# EAGLE design bldc_driver (EAGLE 6.4)
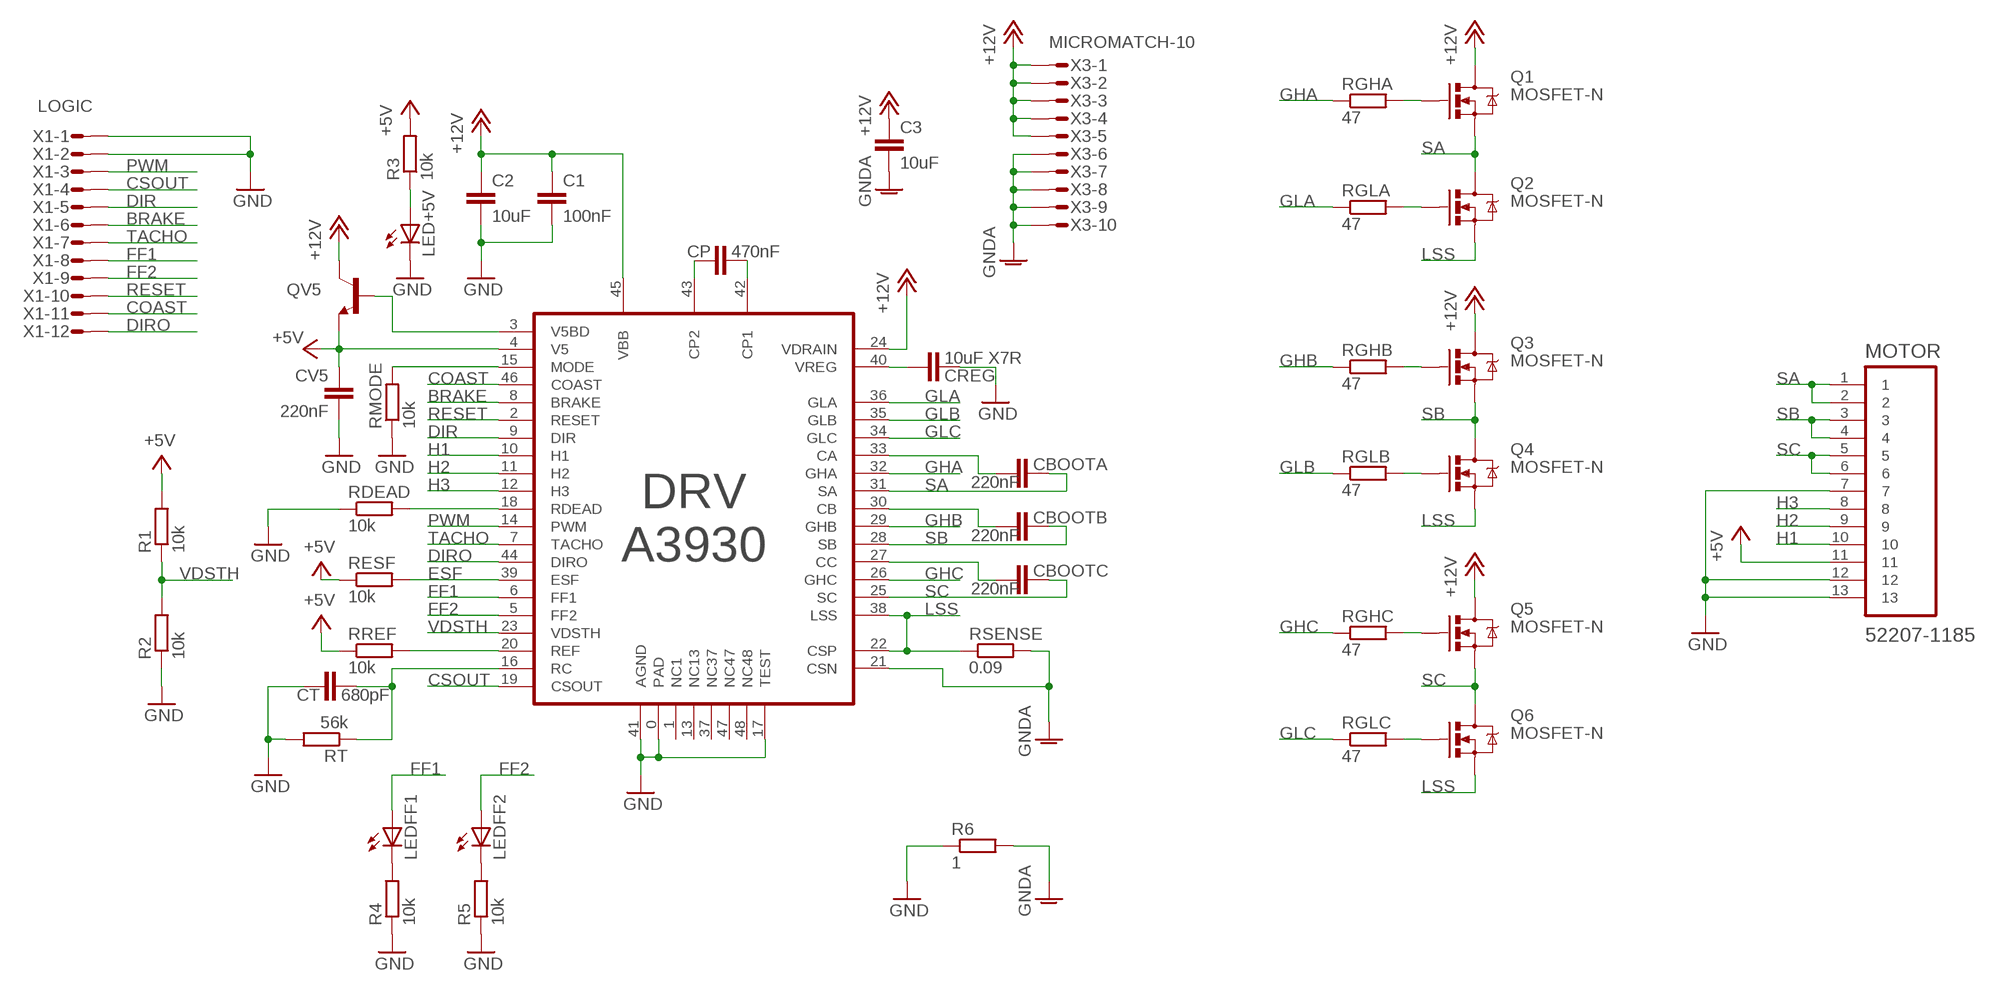
[diagram p0: schematic, sheet 1]

## Parts
C1  100nF  C-EUC0603  [C0603]
C2  10uF  C-EUC1206K  [C1206K]
C3  10uF  C-EUC1206K  [C1206K]
CBOOTA  220nF  C-EUC0603  [C0603]
CBOOTB  220nF  C-EUC0603  [C0603]
CBOOTC  220nF  C-EUC0603  [C0603]
CP  470nF  C-EUC0603  [C0603]
CREG  10uF X7R  C-EUC1206K  [C1206K]
CT  680pF  C-EUC0603  [C0603]
CV5  220nF  C-EUC0603  [C0603]
DRV  A3930  [LQFP-48]
LED+5V  LEDCHIPLED_0603  [CHIPLED_0603]
LEDFF1  LEDCHIPLED_0603  [CHIPLED_0603]
LEDFF2  LEDCHIPLED_0603  [CHIPLED_0603]
MOTOR  52207-1185  [MOLEX_52207-1185]
Q1  MOSFET-N  MOSFET-NCHANNELFDS6630A  [SO08]
Q2  MOSFET-N  MOSFET-NCHANNELFDS6630A  [SO08]
Q3  MOSFET-N  MOSFET-NCHANNELFDS6630A  [SO08]
Q4  MOSFET-N  MOSFET-NCHANNELFDS6630A  [SO08]
Q5  MOSFET-N  MOSFET-NCHANNELFDS6630A  [SO08]
Q6  MOSFET-N  MOSFET-NCHANNELFDS6630A  [SO08]
QV5  TRANSISTOR_NPNSOT23  [SOT23]
R1  10k  R-EU_R0603  [R0603]
R2  10k  R-EU_R0603  [R0603]
R3  10k  R-EU_R0603  [R0603]
R4  10k  R-EU_R0603  [R0603]
R5  10k  R-EU_R0603  [R0603]
R6  1  R-EU_R0603  [R0603]
RDEAD  10k  R-EU_R0603  [R0603]
RESF  10k  R-EU_R0603  [R0603]
RGHA  47  R-EU_R0603  [R0603]
RGHB  47  R-EU_R0603  [R0603]
RGHC  47  R-EU_R0603  [R0603]
RGLA  47  R-EU_R0603  [R0603]
RGLB  47  R-EU_R0603  [R0603]
RGLC  47  R-EU_R0603  [R0603]
RMODE  10k  R-EU_R0603  [R0603]
RREF  10k  R-EU_R0603  [R0603]
RSENSE  0.09  R-EU_R2010  [R2010]
RT  56k  R-EU_R0603  [R0603]
X1  LOGIC  MICROMATCH-12  [MICROMATCH-12]
X3  MICROMATCH-10  [MICROMATCH-10]

## Nets
+5V: CV5.2 DRV.4(V5) MOTOR.11 QV5.2(E) R1.2 R3.2 RESF.1 RREF.1
+12V: C1.1 C2.1 C3.1 DRV.24(VDRAIN) DRV.45(VBB) Q1.5(D) Q1.6(D) Q1.7(D) Q1.8(D) Q3.5(D) Q3.6(D) Q3.7(D) Q3.8(D) Q5.5(D) Q5.6(D) Q5.7(D) Q5.8(D) QV5.3(C) X3.1 X3.2 X3.3 X3.4 X3.5
BRAKE: DRV.8(BRAKE) X1.6
COAST: DRV.46(COAST) X1.11
CSOUT: DRV.19(CSOUT) X1.4
DIR: DRV.9(DIR) X1.5
DIRO: DRV.44(DIRO) X1.12
ESF: DRV.39(ESF) RESF.2
FF1: DRV.6(FF1) LEDFF1.A X1.8
FF2: DRV.5(FF2) LEDFF2.A X1.9
GHA: DRV.32(GHA) RGHA.1
GHB: DRV.29(GHB) RGHB.1
GHC: DRV.26(GHC) RGHC.1
GLA: DRV.36(GLA) RGLA.1
GLB: DRV.35(GLB) RGLB.1
GLC: DRV.34(GLC) RGLC.1
GND: C1.2 C2.2 CREG.2 CT.2 CV5.1 DRV.0(PAD) DRV.17(TEST) DRV.41(AGND) LED+5V.C MOTOR.7 MOTOR.12 MOTOR.13 R2.1 R4.1 R5.1 R6.1 RDEAD.1 RMODE.1 RT.2 X1.1 X1.2
GNDA: C3.2 DRV.21(CSN) R6.2 RSENSE.2 X3.6 X3.7 X3.8 X3.9 X3.10
H1: DRV.10(H1) MOTOR.10
H2: DRV.11(H2) MOTOR.9
H3: DRV.12(H3) MOTOR.8
LSS: DRV.22(CSP) DRV.38(LSS) Q2.1(S) Q2.2(S) Q2.3(S) Q4.1(S) Q4.2(S) Q4.3(S) Q6.1(S) Q6.2(S) Q6.3(S) RSENSE.1
N$1: Q1.4(G) RGHA.2
N$2: Q2.4(G) RGLA.2
N$3: Q3.4(G) RGHB.2
N$4: Q4.4(G) RGLB.2
N$5: Q5.4(G) RGHC.2
N$6: Q6.4(G) RGLC.2
N$7: CBOOTA.1 DRV.33(CA)
N$8: CREG.1 DRV.40(VREG)
N$9: CT.1 DRV.16(RC) RT.1
N$10: CP.1 DRV.42(CP1)
N$11: CP.2 DRV.43(CP2)
N$12: CBOOTB.1 DRV.30(CB)
N$14: DRV.18(RDEAD) RDEAD.2
N$15: CBOOTC.1 DRV.27(CC)
N$16: LED+5V.A R3.1
N$17: DRV.20(REF) RREF.2
N$18: DRV.15(MODE) RMODE.2
N$19: LEDFF1.C R4.2
N$20: LEDFF2.C R5.2
N$21: DRV.3(V5BD) QV5.1(B)
PWM: DRV.14(PWM) X1.3
RESET: DRV.2(RESET) X1.10
SA: CBOOTA.2 DRV.31(SA) MOTOR.1 MOTOR.2 Q1.1(S) Q1.2(S) Q1.3(S) Q2.5(D) Q2.6(D) Q2.7(D) Q2.8(D)
SB: CBOOTB.2 DRV.28(SB) MOTOR.3 MOTOR.4 Q3.1(S) Q3.2(S) Q3.3(S) Q4.5(D) Q4.6(D) Q4.7(D) Q4.8(D)
SC: CBOOTC.2 DRV.25(SC) MOTOR.5 MOTOR.6 Q5.1(S) Q5.2(S) Q5.3(S) Q6.5(D) Q6.6(D) Q6.7(D) Q6.8(D)
TACHO: DRV.7(TACHO) X1.7
VDSTH: DRV.23(VDSTH) R1.1 R2.2
Unconnected: DRV.1(NC1) DRV.13(NC13) DRV.37(NC37) DRV.47(NC47) DRV.48(NC48)

## Library data of the parts
C1-C3 CBOOTA CBOOTB CBOOTC CP CREG CT CV5 = rcl:C-EU: CAPACITOR, European symbol
DRV = rc13:A3930
LED+5V LEDFF1 LEDFF2 = led:LED: LED OSRAM: - CHIPLED LG R971, LG N971, LY N971, LG Q971, LY Q971, LO R971, LY R971 LH N974, LH R974 LS Q976, LO Q976, LY Q976 LO Q996 - Hyper CHIPLED LW Q18S LB Q993, LB Q99A, LB R99A - SideLED LS A670, LO A670, LY A670, LG A670, LP A670 LB A673, LV A673, LT A673, LW A673 LH A674 LY A675 LS A676, LA A676, LO A676, LY A676, LW A676 LS A679, LY A679, LG A679 - Hyper Micro SIDELED® LS Y876, LA Y876, LO Y876, LY Y876 LT Y87S - SmartLED LW L88C, LW L88S LB L89C, LB L89S, LG L890 LS L89K, LO L89K, LY L89K LS L896, LA L896, LO L896, LY L896 - TOPLED LS T670, LO T670, LY T670, LG T670, LP T670 LSG T670, LSP T670, LSY T670, LOP T670, LYG T670 LG T671, LOG T671, LSG T671 LB T673, LV T673, LT T673, LW T673 LH T674 LS T676, LA T676, LO T676, LY T676, LB T676, LH T676, LSB T676, LW T676 LB T67C, LV T67C, LT T67C, LS T67K, LO T67K, LY T67K, LW E67C LS E67B, LA E67B, LO E67B, LY E67B, LB E67C, LV E67C, LT E67C LW T67C LS T679, LY T679, LG T679 LS T770, LO T770, LY T770, LG T770, LP T770 LB T773, LV T773, LT T773, LW T773 LH T774 LS E675, LA E675, LY E675, LS T675 LS T776, LA T776, LO T776, LY T776, LB T776 LHGB T686 LT T68C, LB T68C - Hyper Mini TOPLED® LB M676 - Mini TOPLED Santana® LG M470 LS M47K, LO M47K, LY M47K Source: http://www.osram.convergy.de LUXEON: - LUMILED® LXK2-PW12-R00, LXK2-PW12-S00, LXK2-PW14-U00, LXK2-PW14-V00 LXK2-PM12-R00, LXK2-PM12-S00, LXK2-PM14-U00 LXK2-PE12-Q00, LXK2-PE12-R00, LXK2-PE12-S00, LXK2-PE14-T00, LXK2-PE14-U00 LXK2-PB12-K00, LXK2-PB12-L00, LXK2-PB12-M00, LXK2-PB14-N00, LXK2-PB14-P00, LXK2-PB14-Q00 LXK2-PR12-L00, LXK2-PR12-M00, LXK2-PR14-Q00, LXK2-PR14-R00 LXK2-PD12-Q00, LXK2-PD12-R00, LXK2-PD12-S00 LXK2-PH12-R00, LXK2-PH12-S00 LXK2-PL12-P00, LXK2-PL12-Q00, LXK2-PL12-R00 Source: www.luxeon.com KINGBRIGHT: KA-3528ASYC Source: www.kingbright.com
MOTOR = rc13:52207-1185: SOCKET FPC, SMT, 1MM, 10 WAY; MPN: 52207-1085; OC_FARNELL: 1079938; OC_NEWARK: 58J9503; PACKAGE: SOCKET FPC, SMT, 1MM, 10 WAY; SUPPLIER: Molex
Q1-Q6 = SparkFun-DiscreteSemi:MOSFET-NCHANNEL: Common NMOSFET Parts MFG P/N Store ID Prod ID FDD8780 TRANS-09984 SI7820DN TRANS-11055 FDS6630A IC-08089 2N7002PW TRANS-11151 FQP30N06L COM-10213 TRANS-10060 BSS123LT1G TRANS-08345 BSS138 TRANS-00830 BS170 2N7000; PROD_ID: IC-08089
QV5 = SparkFun-DiscreteSemi:TRANSISTOR_NPN: Generic NPN BJT. MMBT2222 is the common NPN we use. Double check against datasheet- not all devices are the same!
R1-R6 RDEAD RESF RGHA RGHB RGHC RGLA RGLB RGLC RMODE RREF RSENSE RT = rcl:R-EU_: RESISTOR, European symbol
X1 = con-amp-micromatch:MICROMATCH-12: MicroMaTch 12 8-215464-2 / 1-215464-2 Drawing Number C-215464 DDEController.pdf; MF: FARNELL; MPN: 8-215464-2; OC_FARNELL: 3784666; OC_NEWARK: 95H9857
X3 = con-amp-micromatch:MICROMATCH-10: MicroMaTch 10 8-215464-0 / 1-215464-0 Drawing Number C-215464 DDEController.pdf; MF: FARNELL; MPN: 8-215464-0; OC_FARNELL: 3784654; OC_NEWARK: 19J6430

## Board
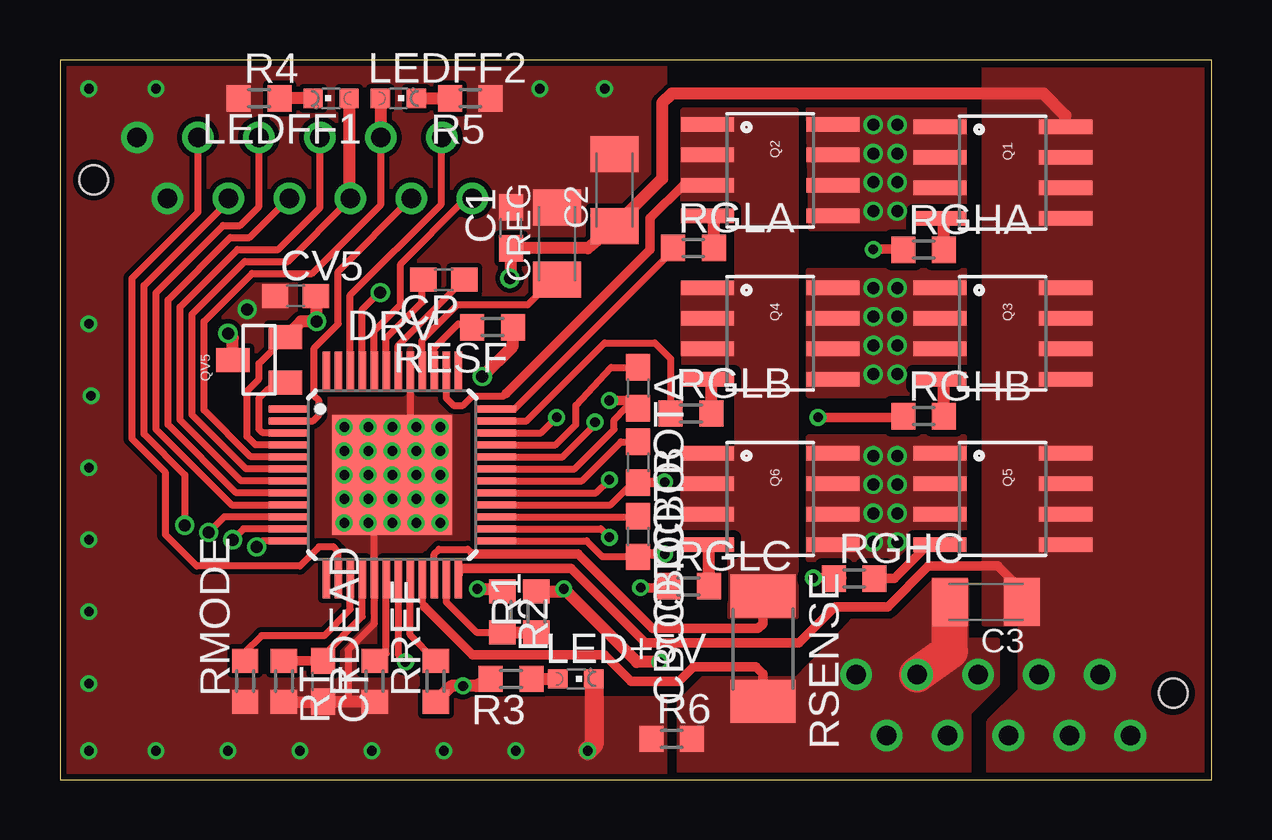
[diagram p1: board, top side]
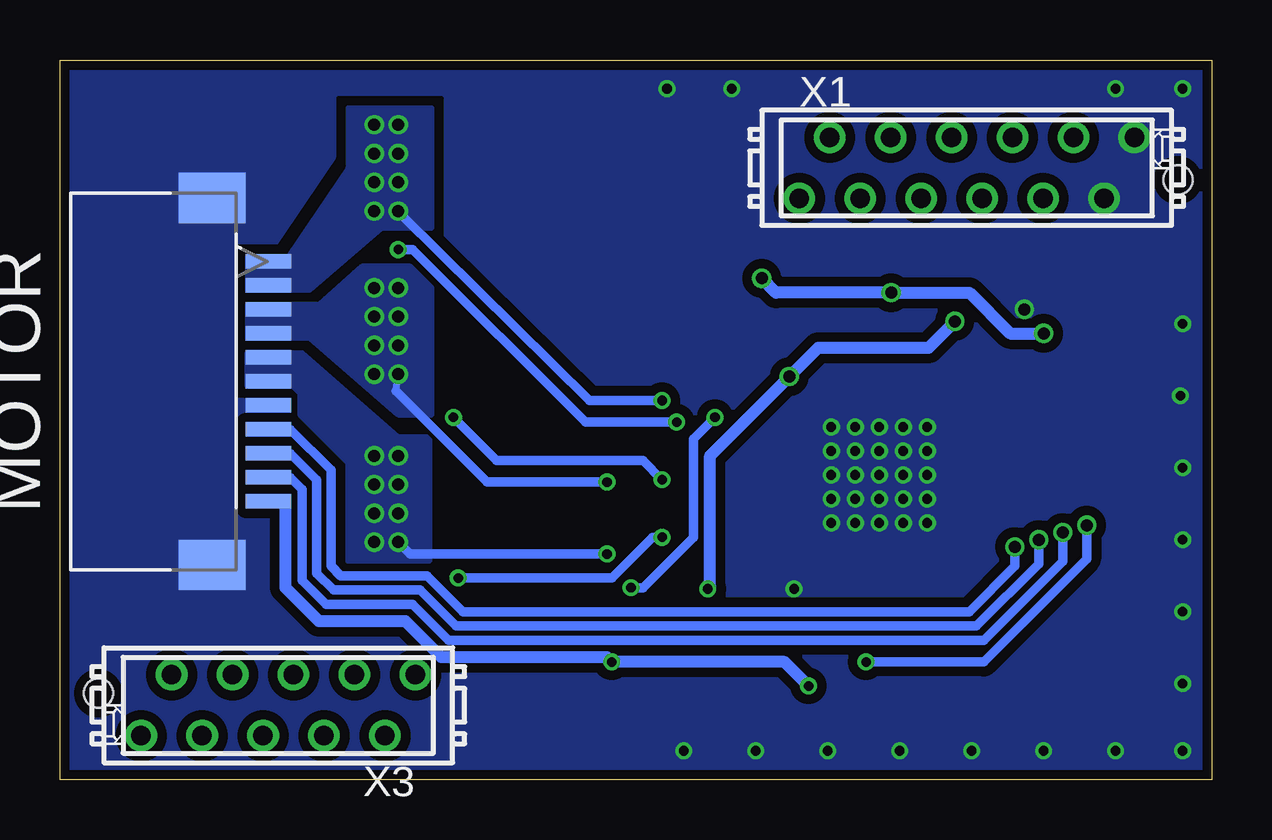
[diagram p2: board, bottom side, seen from below]

Size 48 x 30 mm. Coordinates in mm from the lower left corner, seen from the top.
Outline: 0,0 48,0 48,30 0,30 0,0
Copper layers (1*16): Top 0.035mm / dielectric 1.5mm / Bottom 0.035mm
Design rules "Fusion_eagle_rule_v1.1 *": minimum track width 6mil, minimum drill 12mil, track to track 6mil, track to pad 6mil, pad to pad 6mil, via to via 6mil, smd to smd 0mil, copper to edge 10mil, drill to drill 10mil, minimum pad ring 10mil, minimum via ring 6mil, stop-mask expansion 2mil, vias tented up to drill 100mil, thermal gap 10mil
Holes 1.2 mm at 46.4,3.6 1.4,25

### Footprints (pad centres in the part's own frame; a part is rotated, then mirrored left to right if it is on the bottom)
C0603 = smd 1.1 x 1: 1 -0.85,0; 2 0.85,0
C1206K = smd 1.5 x 2: 1 -1.5,0; 2 1.5,0
LQFP-48 = smd 5 x 5: 0 0,0 | smd 1.7 x 0.3: 1 -4.3,2.75; 2 -4.3,2.25; 3 -4.3,1.75; 4 -4.3,1.25; 5 -4.3,0.75; 6 -4.3,0.25; 7 -4.3,-0.25; 8 -4.3,-0.75; 9 -4.3,-1.25; 10 -4.3,-1.75; 11 -4.3,-2.25; 12 -4.3,-2.75; 25 4.3,-2.75; 26 4.3,-2.25; 27 4.3,-1.75; 28 4.3,-1.25; 29 4.3,-0.75; 30 4.3,-0.25; 31 4.3,0.25; 32 4.3,0.75; 33 4.3,1.25; 34 4.3,1.75; 35 4.3,2.25; 36 4.3,2.75 | smd 0.3 x 1.7: 13 -2.75,-4.3; 14 -2.25,-4.3; 15 -1.75,-4.3; 16 -1.25,-4.3; 17 -0.75,-4.3; 18 -0.25,-4.3; 19 0.25,-4.3; 20 0.75,-4.3; 21 1.25,-4.3; 22 1.75,-4.3; 23 2.25,-4.3; 24 2.75,-4.3; 37 2.75,4.3; 38 2.25,4.3; 39 1.75,4.3; 40 1.25,4.3; 41 0.75,4.3; 42 0.25,4.3; 43 -0.25,4.3; 44 -0.75,4.3; 45 -1.25,4.3; 46 -1.75,4.3; 47 -2.25,4.3; 48 -2.75,4.3
CHIPLED_0603 = smd 0.8 x 0.8: A 0,-0.75; C 0,0.75
MOLEX_52207-1185 = smd 0.6 x 1.9: 1 5,4.8; 2 4,4.8; 3 3,4.8; 4 2,4.8; 5 1,4.8; 6 0,4.8; 7 -1,4.8; 8 -2,4.8; 9 -3,4.8; 10 -4,4.8; 11 -5,4.8 | smd 2.1 x 2.8: 12 -7.65,7.15 | smd 2.108 x 2.794: 13 7.65,7.15
SO08 = smd 0.61 x 2.21: 1 -1.905,-2.616; 2 -0.635,-2.616; 3 0.635,-2.616; 4 1.905,-2.616; 5 1.905,2.616; 6 0.635,2.616; 7 -0.635,2.616; 8 -1.905,2.616
SOT23 = smd 1 x 1.4: 1 -0.95,-1.1; 2 0.95,-1.1; 3 0,1.1
R0603 = smd 1 x 1.1: 1 -0.85,0; 2 0.85,0
R2010 = smd 1.8 x 2.7: 1 -2.2,0; 2 2.2,0
MICROMATCH-12 = drill 0.813: 1 6.985,1.27; 2 5.715,-1.27; 3 4.445,1.27; 4 3.175,-1.27; 5 1.905,1.27; 6 0.635,-1.27; 7 -0.635,1.27; 8 -1.905,-1.27; 9 -3.175,1.27; 10 -4.445,-1.27; 11 -5.715,1.27; 12 -6.985,-1.27
MICROMATCH-10 = drill 0.813: 1 5.715,1.27; 2 4.445,-1.27; 3 3.175,1.27; 4 1.905,-1.27; 5 0.635,1.27; 6 -0.635,-1.27; 7 -1.905,1.27; 8 -3.175,-1.27; 9 -4.445,1.27; 10 -5.715,-1.27

### Placement (x,y rotation side)
C1  18.8,23 90 top
C2  23.12,24.57 90 top
C3  38.6,7.4 180 top
CBOOTA  24.1,16.33 270 top
CBOOTB  24.1,13.23 270 top
CBOOTC  24.1,10.13 270 top
CP  16,20.84 180 top
CREG  20.72,22.35 90 top
CT  10.96,4.1 270 top
CV5  9.82,20.16 0 top
DRV  13.85,12.7 0 top
LED+5V  21.5,4.2 270 top
LEDFF1  11.3,28.4 90 top
LEDFF2  14.1,28.4 270 top
MOTOR  34.51,16.6 90 bottom
Q1  39.3,25.3 270 top
Q2  29.6,25.4 270 top
Q3  39.3,18.6 270 top
Q4  29.6,18.6 270 top
Q5  39.3,11.7 270 top
Q6  29.6,11.7 270 top
QV5  8.3,17.5 90 top
R1  19.86,6.99 90 top
R2  18.44,6.99 270 top
R3  18.8,4.2 180 top
R4  8.3,28.4 0 top
R5  17.1,28.4 180 top
R6  25.5,1.7 0 top
RDEAD  13.12,4.1 90 top
RESF  18.03,18.86 180 top
RGHA  36,22.09 0 top
RGHB  36,15.15 0 top
RGHC  33.1,8.38 0 top
RGLA  26.4,22.16 0 top
RGLB  26.3,15.26 0 top
RGLC  26.2,8.06 0 top
RMODE  7.72,4.1 90 top
RREF  15.66,4.1 90 top
RSENSE  29.3,5.46 270 top
RT  9.34,4.1 270 top
X1  10.2,25.5 0 bottom
X3  38.9,3.1 180 bottom

### Tracks (layer width: path | path; a pad name or v marks a point on that pad's centre or on a via)
+5V  (via drill 0.4, 0.5)
  Top 0.3: DRV.4 8.15,13.95 7.8,14.3 7.8,16.2 8.3,16.7 8.3,17.35 QV5.2
  Top 0.5: 15.9,3.31 RREF.1 16.31,3.9 v16.8,3.9 17.35,3.9 R3.2 | QV5.2 10.05,19.1 v10.7,19.1 10.7,20.03 CV5.2 | R1.2 21,7.84 v21,7.95 24.05,4.9 v25,4.9 | v17.6,16.8 18.88,18.08 RESF.1
  Bottom 0.5: v10.7,19.1 11.8,18 16.4,18 v17.6,16.8 20.9,13.5 20.9,8.05 v21,7.95 | v16.8,3.9 17.8,4.9 v25,4.9 25.2,5.1 32.1,5.1 33.6,6.6 37.2,6.6 38.6,8 38.6,11.6 MOTOR.11
+12V  (via drill 0.5, 0.5 pad 0.8)
  Top 0.3: DRV.45 12.6,19.6 13.15,20.15 v13.35,20.3 | 16.7,8.8 DRV.24
  Top 0.4: C3.1 40.1,7.9 39.1,8.9 36.2,8.9 34.5,7.2 32.3,7.2 30.8,5.7 24.4,5.7 21.3,8.8 16.7,8.8
  Top 0.5: QV5.3 7.2,18.4 v7,18.6 | Q1.8 41.92,27.68 41,28.6 25.5,28.6 25.1,28.2 25.1,25.05 C2.1 22,22.15 C1.1 18.8,20.9 v18.75,20.9
  Bottom 0.5: v7,18.6 8.4,18.6 10.1,20.3 v13.35,20.3 18.15,20.3 v18.75,20.9
  pour Top (isolate 0.3, no thermals): 40,6.5 40,3.7 38.7,2.4 38.7,0 48,0 48,30 38.5,30 38.5,6.5
BRAKE
  Top 0.3: DRV.8 7.35,11.95 4.5,14.8 4.5,20 7.1,22.6 7.9,22.6 9.46,24.16 X1.6
COAST
  Top 0.3: DRV.46 12.1,20.2 15.9,24 15.9,26.75 X1.11
CSOUT  (via drill 0.4, 0.5)
  Top 0.3: X1.4 6.62,23.73 3.5,20.6 3.5,14.4 5.2,12.7 v5.2,10.6 | DRV.19 14.1,5.2 v14.4,4.9
  Bottom 0.4: v5.2,10.6 5.2,9.2 9.5,4.9 v14.4,4.9
DIR
  Top 0.3: DRV.9 7.15,11.45 4,14.6 4,20.3 6.8,23.1 7.5,23.1 8.29,23.89 X1.5
DIRO
  Top 0.3: DRV.44 13.1,18.7 14.2,19.8 14.2,21.5 16.83,24.13 X1.12
ESF
  Top 0.3: DRV.39 15.6,18 16.6,19 16.94,19 RESF.2
FF1
  Top 0.3: DRV.6 7.75,12.95 5.5,15.2 5.5,19.4 7.7,21.6 9.5,21.6 12.01,24.11 X1.8
  Top 0.5: LEDFF1.A 12.05,24.27 X1.8
FF2
  Top 0.3: DRV.5 7.95,13.45 6,15.4 6,19.1 8,21.1 10.5,21.1 13.38,23.98 X1.9
  Top 0.5: X1.9 13.38,28.38 LEDFF2.A
GHA  (via drill 0.4)
  Top 0.3: DRV.32 20.95,13.45 22.3,14.8 v22.3,14.9 | RGHA.1 34.99,22.11 | v33.91,22.11 v33.9,22.1
  Top 0.4: 34.99,22.11 v33.91,22.11
  Bottom 0.4: v33.9,22.1 33.3,22.1 26.1,14.9 v22.3,14.9
GHB  (via drill 0.4)
  Top 0.3: DRV.29 22.35,11.95 v22.9,12.5 | 35.14,15.1 RGHB.1
  Top 0.4: v31.6,15.1 35.14,15.1
  Bottom 0.4: v31.6,15.1 29.8,13.3 23.7,13.3 v22.9,12.5
GHC  (via drill 0.4)
  Top 0.3: DRV.26 22.55,10.45 v22.9,10.1 | 32.6,8.4 RGHC.1
  Top 0.4: v31.4,8.4 32.6,8.4
  Bottom 0.4: v31.4,8.4 25,8.4 23.3,10.1 v22.9,10.1
GLA
  Top 0.3: DRV.36 18.95,15.45 25.3,21.8 25.3,22.11 RGLA.1 25.36,21.86
GLB
  Top 0.3: DRV.35 19.45,14.95 22.7,18.2 24.8,18.2 25.45,17.55 RGLB.1
GLC  (via drill 0.4)
  Top 0.3: DRV.34 20.05,14.45 v20.7,15.1
  Top 0.4: v24.2,8 25.29,8 RGLC.1
  Bottom 0.4: v20.7,15.1 21.6,14.2 21.6,10.1 23.7,8 v24.2,8
GND  (via drill 0.4, 0.5)
  Top 0.3: DRV.41 14.6,13.45 | 12,3.27 12,5.4 13.1,6.5 DRV.17 13.1,11.95 v12.85,11.7
  Top 0.5: 9.63,3.43 RT.2 10.91,3.22 CT.2 12,3.27 13.12,3.27 RDEAD.1 | 14.6,13.45 v13.85,13.7 | v17.4,7.95 18.44,7.95 R2.1
  Top 0.8: LED+5V.C 22.25,1.45 v22,1.2
  other vias: 20,28.8 1.2,19 1.2,10 1.2,1.2 19,1.2 7.8,19.6 10,1.2 11.85,14.7 12.85,14.7 13.85,14.7 15.85,14.7 11.85,13.7 12.85,13.7 15.85,13.7 11.85,11.7 13.85,11.7 15.85,11.7 11.85,10.7 13.85,10.7 12.85,10.7 15.85,10.7 13.85,12.7 11.85,12.7 12.85,12.7 14.85,14.7 14.85,13.7 14.85,12.7 15.85,12.7 14.85,11.7 14.85,10.7 4,1.2 7,1.2 13,1.2 16,1.2 1.2,4 1.2,7 1.2,13 1.3,16 22.7,28.8 1.2,28.8 4,28.8
  pour Bottom (isolate 0.4, rank 2, no thermals): 0,0 48,0 48,30 0,30
  pour Top (isolate 0.2, no thermals): 0,0 0,30 25.2,30 25.2,0
GNDA
  Top 0.3: DRV.21 15.1,7.4 15.2,7.2
  Top 0.4: 15.2,7.2 17.2,5.2 22.7,5.2 23.8,4.1 25.8,4.1 26.4,4.7 29,4.7 29.3,4.4 RSENSE.2
  Top 1.5: X3.8 37.1,5.34 C3.2
  pour Top (isolate 0.3, no thermals): 37.9,0 37.9,2.8 39.1,4 39.1,5.8 37.8,5.8 37.8,8.3 36.4,8.3 34.7,6.6 33,6.6 30.7,4.2 26.8,4.2 25.8,3.2 25.8,0
H1  (via drill 0.5)
  Top 0.3: DRV.10 6.85,10.95 v6.2,10.3
  Bottom 0.4: v6.2,10.3 6.2,9.1 9.5,5.8 31.8,5.8 33.3,7.3 36.9,7.3 37.9,8.3 37.9,12.1 38.4,12.6 MOTOR.10
H2  (via drill 0.5)
  Top 0.3: DRV.11 7.65,10.45 v7.2,10
  Bottom 0.4: v7.2,10 7.2,9 9.8,6.4 31.5,6.4 33,7.9 36.6,7.9 37.3,8.6 37.3,12.5 38.4,13.6 MOTOR.9
H3  (via drill 0.5)
  Top 0.3: 9.05,9.95 DRV.12 8.45,9.95 v8.2,9.7
  Bottom 0.4: v8.2,9.7 8.2,8.9 10.1,7 31.2,7 32.7,8.5 36.3,8.5 36.7,8.9 36.7,12.9 38.4,14.6 MOTOR.8
LSS
  Top 0.3: 26.92,24.7 Q2.3 | DRV.22 15.6,9.4 15.8,9.6 17,9.6 17.2,9.4 | DRV.38 16.1,15.9 16.4,15.6 16.8,15.6 17.2,16 18.5,16 18.6,16.1
  Top 0.4: 17.2,9.4 21.6,9.4 24.7,6.3 29.1,6.3 29.3,6.5 RSENSE.1 | Q2.3 26.95,24.8 26,24.8 24.6,23.4 24.6,22.1 18.6,16.1
  pour Top (isolate 0.3, no thermals): 25.95,27.9 25.95,23.9 28.2,23.9 28.2,20.7 25.95,20.7 25.95,17.1 28.2,17.1 28.2,13.8 25.95,13.8 25.95,10.2 27.9,10.2 27.9,6.8 30.7,6.8 30.7,27.9
N$1
  Top 0.5: RGHA.2 36.85,23.23 Q1.4
N$2
  Top 0.5: RGLA.2 27.25,23.5 Q2.4
N$3
  Top 0.5: RGHB.2 36.85,16.53 Q3.4
N$4
  Top 0.5: RGLB.2 27.15,16.59 Q4.4
N$5
  Top 0.4: RGHC.2 34.78,8.38 36.2,9.79 Q5.4
N$6
  Top 0.5: RGLC.2 27.05,9.79 Q6.4
N$7
  Top 0.3: DRV.33 20.65,13.95 21.5,14.8 21.5,15.6 22.97,17.17 22.98,17.18 CBOOTA.1
N$8
  Top 0.3: DRV.40 15.1,18.33 16.57,19.8 19.5,19.8 20.42,20.72 CREG.1
N$9
  Top 0.3: DRV.16 12.6,6.8 10.96,5.16 CT.1 10.81,4.92
  Top 0.4: RT.1 CT.1
N$10
  Top 0.3: DRV.42 14.1,18.1 16.6,20.6 16.6,20.89 CP.1
N$11
  Top 0.3: DRV.43 13.6,18.4 15.1,19.9 15.1,21.09 CP.2
N$12
  Top 0.3: DRV.30 21.75,12.45 23.38,14.08 CBOOTB.1
N$13
  cutout Top: 15.2,9.4 15.1,3.6 25.1,3.6 20.3,9.6 16.7,9.6
N$14
  Top 0.3: RDEAD.2 13.6,5.26 DRV.18
N$15
  Top 0.3: DRV.27 24.07,10.95 CBOOTC.1
N$16
  Top 0.5: R3.1 LED+5V.A
N$17
  Top 0.3: RREF.2 14.6,6.03 DRV.20
N$18
  Top 0.3: RMODE.2 7.72,5.32 8.4,6 11,6 12.1,7.1 DRV.15
N$19
  Top 0.5: LEDFF1.C R4.2
N$20
  Top 0.5: LEDFF2.C R5.2
N$21
  Top 0.3: DRV.3 8.45,14.45 8.3,14.6 8.3,15.9 8.7,16.3 9.05,16.3 QV5.1
PWM
  Top 0.3: X1.3 5.75,23.66 3,20.9 3,14.2 4.4,12.8 4.4,10.2 5.7,8.9 10,8.9 10.8,9.7 11.4,9.7 11.6,9.5 DRV.14
RESET
  Top 0.3: DRV.2 10.55,14.95 10.8,15.2 10.8,15.8 10.6,16 10.6,18 11.6,19 11.6,21.18 X1.10
SA  (via drill 0.4, 0.5)
  Top 0.3: DRV.31 21.45,12.95 23.1,14.6 23.1,15 23.58,15.48 23.98,15.48 CBOOTA.2
  Top 0.4: 23.98,15.48 23.66,15.8 v22.9,15.8
  Bottom 0.3: 33.72,23.5 33.99,23.5 v33.9,23.7
  Bottom 0.4: v22.9,15.8 25.92,15.8 33.72,23.5
  other vias: 33.9,27.3 33.9,26.1 33.9,24.9 34.9,27.3 34.9,26.1 34.9,24.9 34.9,23.7
  pour Top (isolate 0.3, no thermals): 31.2,28 37.7,28 37.7,22.95 31.3,22.95
  pour Bottom (no thermals): 40.2,20.4 37.6,20.4 34.6,23 32.5,23 32.5,28 36,28 36,25.5 38.5,21.8 40.2,21.8
SB  (via drill 0.4, 0.5)
  Top 0.3: DRV.28 22.95,11.45 23.98,12.48 CBOOTB.2
  Top 0.4: CBOOTB.2 25.08,12.38 v25.2,12.4
  Bottom 0.3: 34,16.2 v33.9,16.9
  Bottom 0.4: v25.2,12.4 30.2,12.4 34,16.2
  other vias: 33.9,20.5 33.9,19.3 33.9,18.1 34.9,20.5 34.9,19.3 34.9,18.1 34.9,16.9
  pour Top (isolate 0.3, no thermals): 31.2,21.25 37.7,21.25 37.7,16 31.2,16
  pour Bottom (no thermals): 33.4,21.4 35.4,21.4 37.2,19.8 40.2,19.8 40.2,18.4 37.6,18.4 33.9,15.2 32.5,15.2 32.5,20.5
SC  (via drill 0.4, 0.5)
  Top 0.3: DRV.25 21.95,9.95 22.6,9.3 24,9.3 CBOOTC.2
  Top 0.4: CBOOTC.2 24.22,9.4 v25.2,9.4
  Bottom 0.4: v25.2,9.4 33.4,9.4 v33.9,9.9
  other vias: 33.9,13.5 33.9,12.3 33.9,11.1 34.9,9.9 34.9,11.1 34.9,12.3 34.9,13.5
  pour Top (isolate 0.3, no thermals): 31.2,14.3 37.7,14.3 37.7,9.15 31.2,9.15
  pour Bottom (no thermals): 40.2,17.8 37.9,17.8 33.9,14.3 32.6,14.3 32.6,9.1 36,9.1 36,13.2 38,15.2 38,16.1 38.3,16.4 40.2,16.4
TACHO
  Top 0.3: DRV.7 7.55,12.45 5,15 5,19.7 7.4,22.1 9.1,22.1 10.84,23.84 X1.7
VDSTH
  Top 0.3: DRV.23 16.1,7.4 17.36,6.14 R2.2
  Top 0.5: R2.2 R1.1